# EAGLE design adapter (EAGLE 9.6.2)
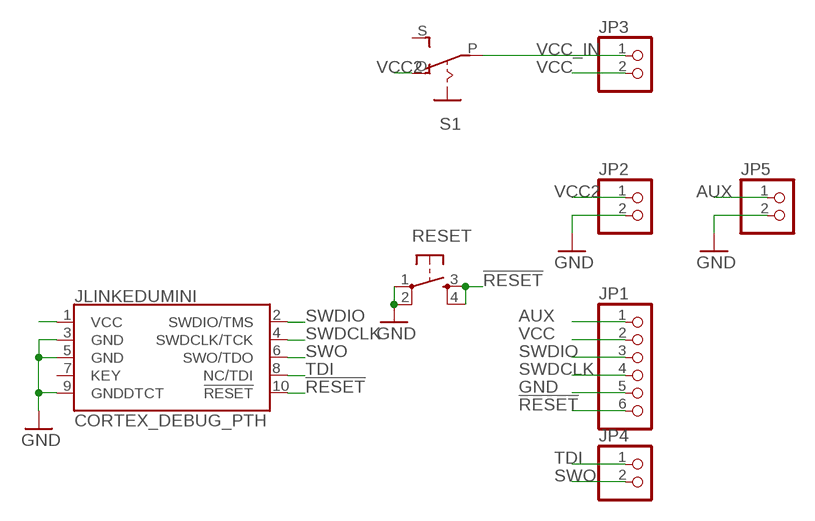
[diagram p0: schematic, sheet 1]

## Parts
JLINKEDUMINI  CORTEX_DEBUG_PTH  [2X5-PTH-1.27MM]
JP1  PINHD-1X6  [1X06]
JP2  PINHD-1X2  [1X02]
JP3  PINHD-1X2  [1X02]
JP4  PINHD-1X2  [1X02]
JP5  PINHD-1X2  [1X02]
RESET  TAC_SWITCHPTH  [TACTILE-PTH]
S1  S-ON-ON  [ES_100SP1T6B11M2QEH]

## Nets
!RESET: JLINKEDUMINI.10(!RESET) JP1.6 RESET.3 RESET.4
AUX: JP1.1 JP5.1
GND: JLINKEDUMINI.3(GND) JLINKEDUMINI.5(GND) JLINKEDUMINI.9(GNDDTCT) JP1.5 JP2.2 JP5.2 RESET.1 RESET.2
SWDCLK: JLINKEDUMINI.4(SWDCLK/TCK) JP1.4
SWDIO: JLINKEDUMINI.2(SWDIO/TMS) JP1.3
SWO: JLINKEDUMINI.6(SWO/TDO) JP4.2
TDI: JLINKEDUMINI.8(NC/TDI) JP4.1
VCC: JLINKEDUMINI.1(VCC) JP1.2 JP3.2
VCC2: JP2.1 S1.O
VCC_IN: JP3.1 S1.P
Unconnected: JLINKEDUMINI.7(KEY) S1.S

## Library data of the parts
JLINKEDUMINI = jhbruhn-physical:CORTEX_DEBUG: Cortex Debug Connector - 10 pin Supports JTAG debug, Serial Wire debug, and Serial Wire Viewer. PTH and SMD connector options available. General Connector Information <http://infocenter.arm.com/help/topic/com.arm.doc.faqs/attached/13634/cortex_debug_connectors.pdf> Products: PTH Connector <http://www.digikey.com/product-detail/en/cnc-tech/3220-10-0100-00/1175-1627-ND/3883661> -via Digi-Key SparkFun PSoc <https://www.sparkfun.com/products/13229> SparkFun T <https://www.sparkfun.com/products/13810>
JP1 = pinhead:PINHD-1X6: PIN HEADER
JP2-JP5 = pinhead:PINHD-1X2: PIN HEADER
RESET = jhbruhn-physical:TAC_SWITCH: Momentary Switch Button commonly used for reset or general input. Spark Fun Electronics SKU : COM-00097
S1 = jhbruhn-physical:S-ON-ON: On-on Switch

## Board
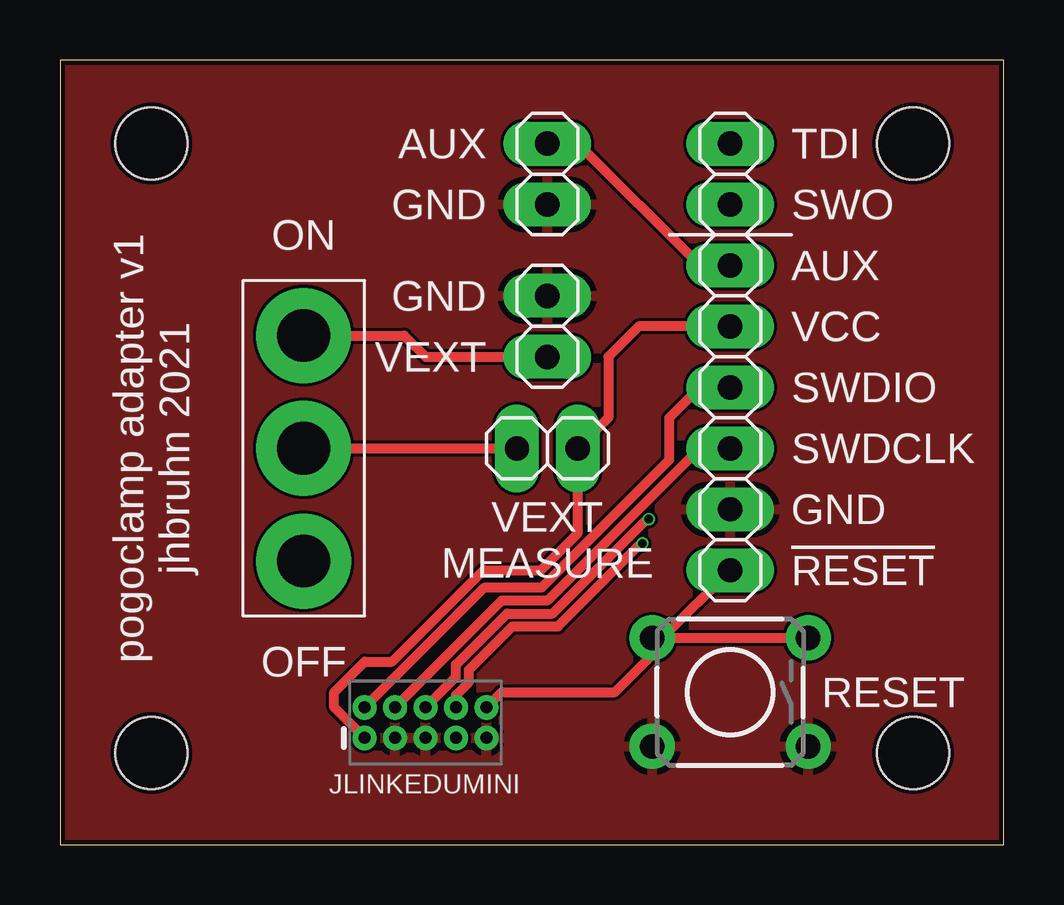
[diagram p1: board, top side]
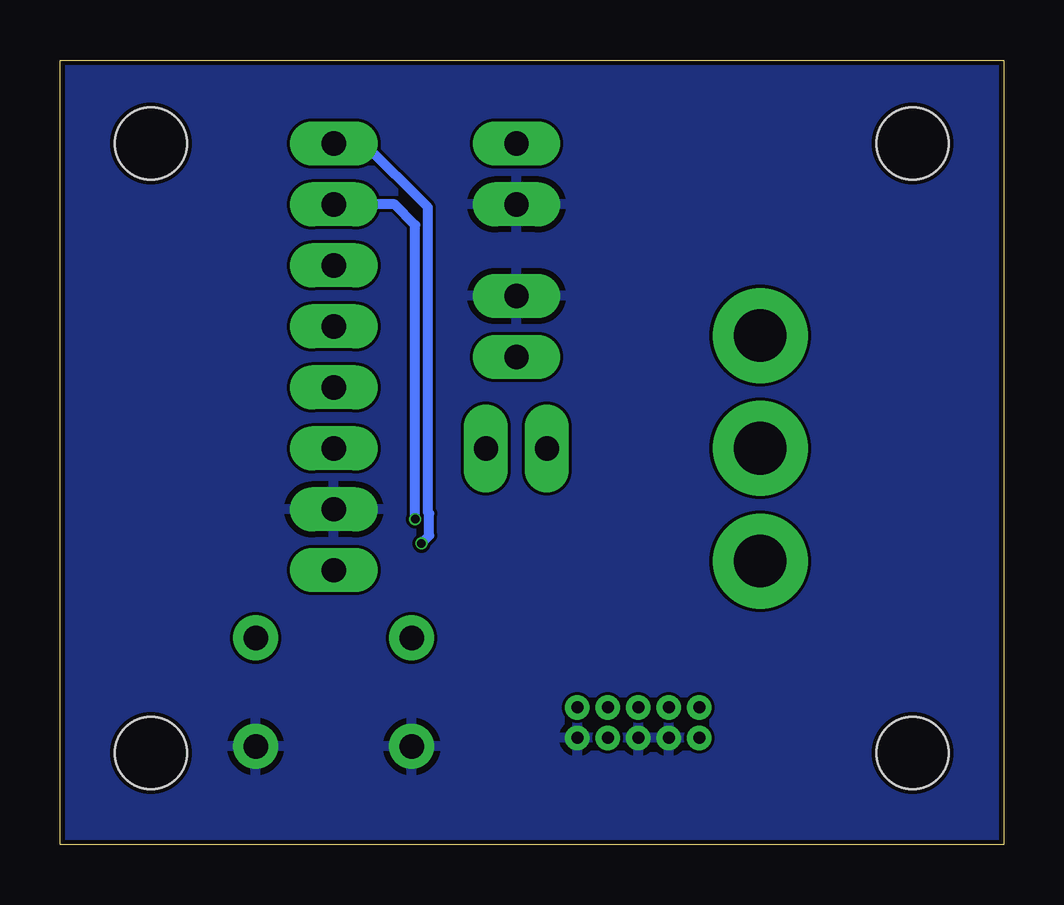
[diagram p2: board, bottom side, seen from below]

Size 39.35 x 32.69 mm. Coordinates in mm from the lower left corner, seen from the top.
Outline: 0,0 39.35,0 39.35,32.69 0,32.69 0,0
Copper layers (1*16): Top 0.035mm / dielectric 1.6mm / Bottom 0.035mm
Design rules "jlcpcb-2layers": minimum track width 5mil, minimum drill 0.3mm, track to track 5mil, track to pad 5mil, pad to pad 5mil, via to via 5mil, smd to smd 5mil, copper to edge 0.2mm, drill to drill 6mil, minimum pad ring 10mil, minimum via ring 3mil, stop-mask expansion 4mil, vias tented up to drill 0mil, thermal gap 10mil
Holes 3 mm at 3.81,29.21 35.56,3.81 35.56,29.21 3.81,3.81

### Footprints (pad centres in the part's own frame; a part is rotated, then mirrored left to right if it is on the bottom)
2X5-PTH-1.27MM = drill 0.508 pad 1: 1 -2.54,-0.635; 2 -2.54,0.635; 3 -1.27,-0.635; 4 -1.27,0.635; 5 0,-0.635; 6 0,0.635; 7 1.27,-0.635; 8 1.27,0.635; 9 2.54,-0.635; 10 2.54,0.635
1X06 = drill 1.016 long: 1 -6.35,0; 2 -3.81,0; 3 -1.27,0; 4 1.27,0; 5 3.81,0; 6 6.35,0
1X02 = drill 1.016 long: 1 -1.27,0; 2 1.27,0
TACTILE-PTH = drill 1.016 pad 1.88: 1 -3.251,2.261; 2 3.251,2.261; 3 -3.251,-2.261; 4 3.251,-2.261
ES_100SP1T6B11M2QEH = drill 2.2 pad 3.048: O -4.699,0; P 0,0; S 4.699,0

### Placement (x,y rotation side)
JLINKEDUMINI  15.24,5.08 0 top
JP1  27.94,17.78 270 top
JP2  20.32,21.59 90 top
JP3  20.32,16.51 0 top
JP4  27.94,27.94 270 top
JP5  20.32,27.94 270 top
RESET  27.94,6.35 180 top
S1  10.16,16.51 270 top
U$1  [FERN_PATTERN_MULTI]  3.81,-85.09 45 bottom  (outside the outline)

### Tracks (layer width: path | path; a pad name or v marks a point on that pad's centre or on a via)
!RESET
  Top 0.406: 25.4,8.61 RESET.4 25.12,8.61 JP1.6 | 25.4,8.61 RESET.3 | JLINKEDUMINI.10 18.41,6.35 23.14,6.35 25.4,8.61
AUX
  Top 0.406: JP1.1 26.67,24.13 21.59,29.21 JP5.1
GND
  pour Top: -3.81,31.75 -3.81,0 40.64,0 40.64,31.75 39.37,33.02 -2.54,33.02
  pour Bottom: 40.64,31.75 40.64,0 -5.08,0 -5.08,31.75 -3.81,33.02 39.37,33.02
SWDCLK
  Top 0.406: JP1.4 26.67,16.51 20.32,10.16 18.41,10.16 JLINKEDUMINI.4
SWDIO
  Top 0.406: JLINKEDUMINI.2 17.7,10.72 20.09,10.72 25.4,16.03 25.4,17.78 26.67,19.05 JP1.3
SWO  (via drill 0.35)
  Top 0.406: JLINKEDUMINI.6 16.51,6.98 16.51,7.5 18.64,9.63 20.54,9.63 24.51,13.59 v24.54,13.56
  Bottom 0.406: v24.54,13.56 24.54,25.81 25.4,26.67 JP4.2
TDI  (via drill 0.35)
  Top 0.406: JLINKEDUMINI.8 16.51,6.23 17.04,6.76 17.04,7.28 18.86,9.09 20.76,9.09 24.21,12.55 v24.28,12.55
  Bottom 0.406: v24.28,12.55 23.96,12.87 23.96,13.8 24.01,13.85 24.01,26.55 26.67,29.21 JP4.1
VCC
  Top 0.406: JP1.2 24.13,21.59 22.86,20.32 22.86,17.78 JP3.2 21.59,12.97 20.05,11.43 17.66,11.43 13.85,7.62 12.7,7.62 11.43,6.35 11.43,5.71 JLINKEDUMINI.1
VCC2
  Top 0.406: S1.O 14.35,21.21 15.24,20.32 JP2.1
VCC_IN
  Top 0.406: S1.P JP3.1

### Text on the board
tNames: AUX | TDI | GND | SWO | ON | AUX | GND | VCC | VEXT | SWDIO | pogoclamp adapter v1 / jhbruhn 2021 | SWDCLK | GND | VEXT / MEASURE | !RESET | OFF